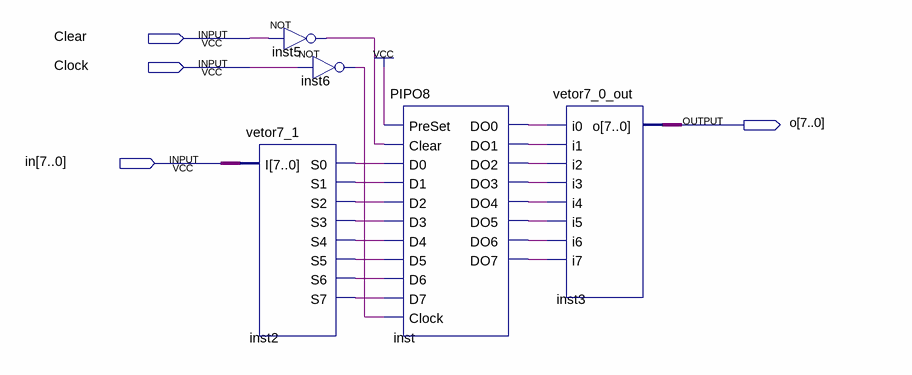
[diagram p0: schematic sheet]
// Quartus schematic PIPO8_vetor.bdf as structural Verilog: 5 symbols, 4 pins
module PIPO8_vetor (
  input  Clear,
  input  Clock,
  input  [7:0] in,
  output [7:0] o
);

  wire inst2_s0, inst2_s1, inst2_s2, inst2_s3, inst2_s4, inst2_s5, inst2_s6, inst2_s7, inst5_out, inst6_out,
       inst_do0, inst_do1, inst_do2, inst_do3, inst_do4, inst_do5, inst_do6, inst_do7;

  not inst5 (inst5_out, Clear);
  not inst6 (inst6_out, Clock);
  vetor7_1 inst2 (
    .I(in), .S0(inst2_s0), .S1(inst2_s1), .S2(inst2_s2), .S3(inst2_s3), .S4(inst2_s4), .S5(inst2_s5),
    .S6(inst2_s6), .S7(inst2_s7));
  PIPO8 inst (
    .PreSet(1'b1), .Clear(inst5_out), .D0(inst2_s0), .D1(inst2_s1), .D2(inst2_s2), .D3(inst2_s3),
    .D4(inst2_s4), .D5(inst2_s5), .D6(inst2_s6), .D7(inst2_s7), .Clock(inst6_out), .DO0(inst_do0),
    .DO1(inst_do1), .DO2(inst_do2), .DO3(inst_do3), .DO4(inst_do4), .DO5(inst_do5), .DO6(inst_do6),
    .DO7(inst_do7));
  vetor7_0_out inst3 (
    .i0(inst_do0), .i1(inst_do1), .i2(inst_do2), .i3(inst_do3), .i4(inst_do4), .i5(inst_do5), .i6(inst_do6),
    .i7(inst_do7), .o(o));
endmodule
